# EAGLE schematic 408_jetracer_append_board (EAGLE 9.6.2)
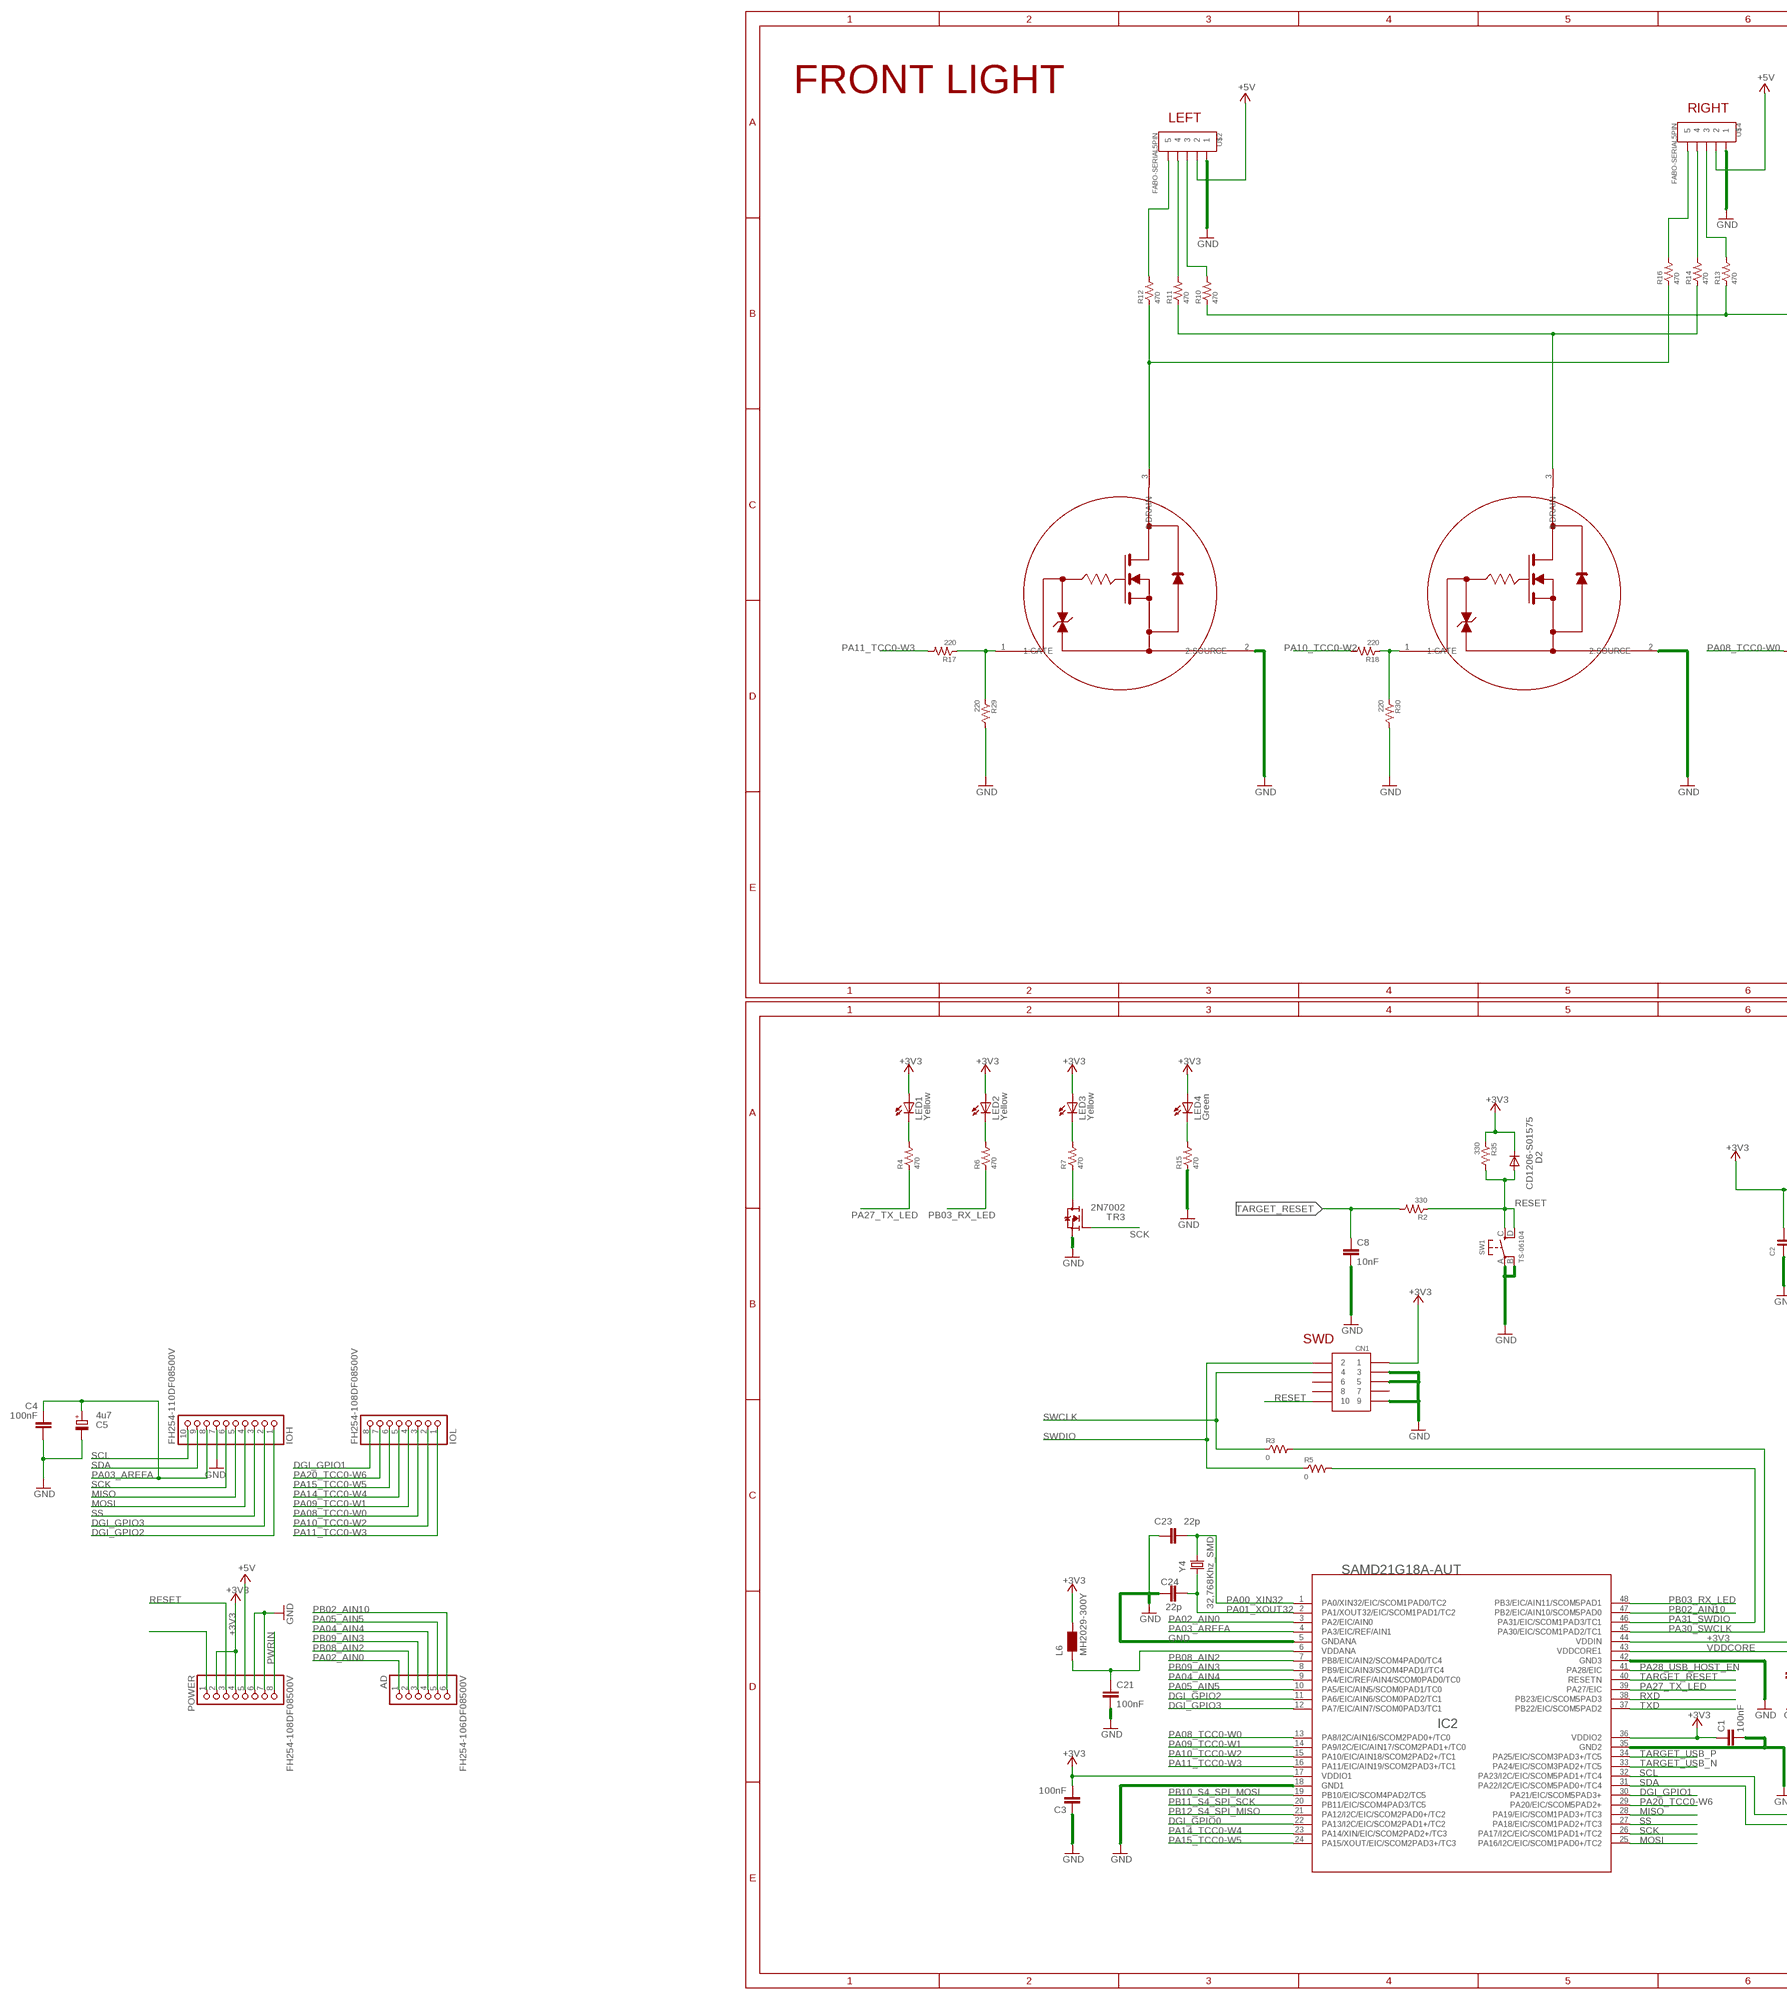
[diagram p0: schematic, sheet 1, part 1 of 2]
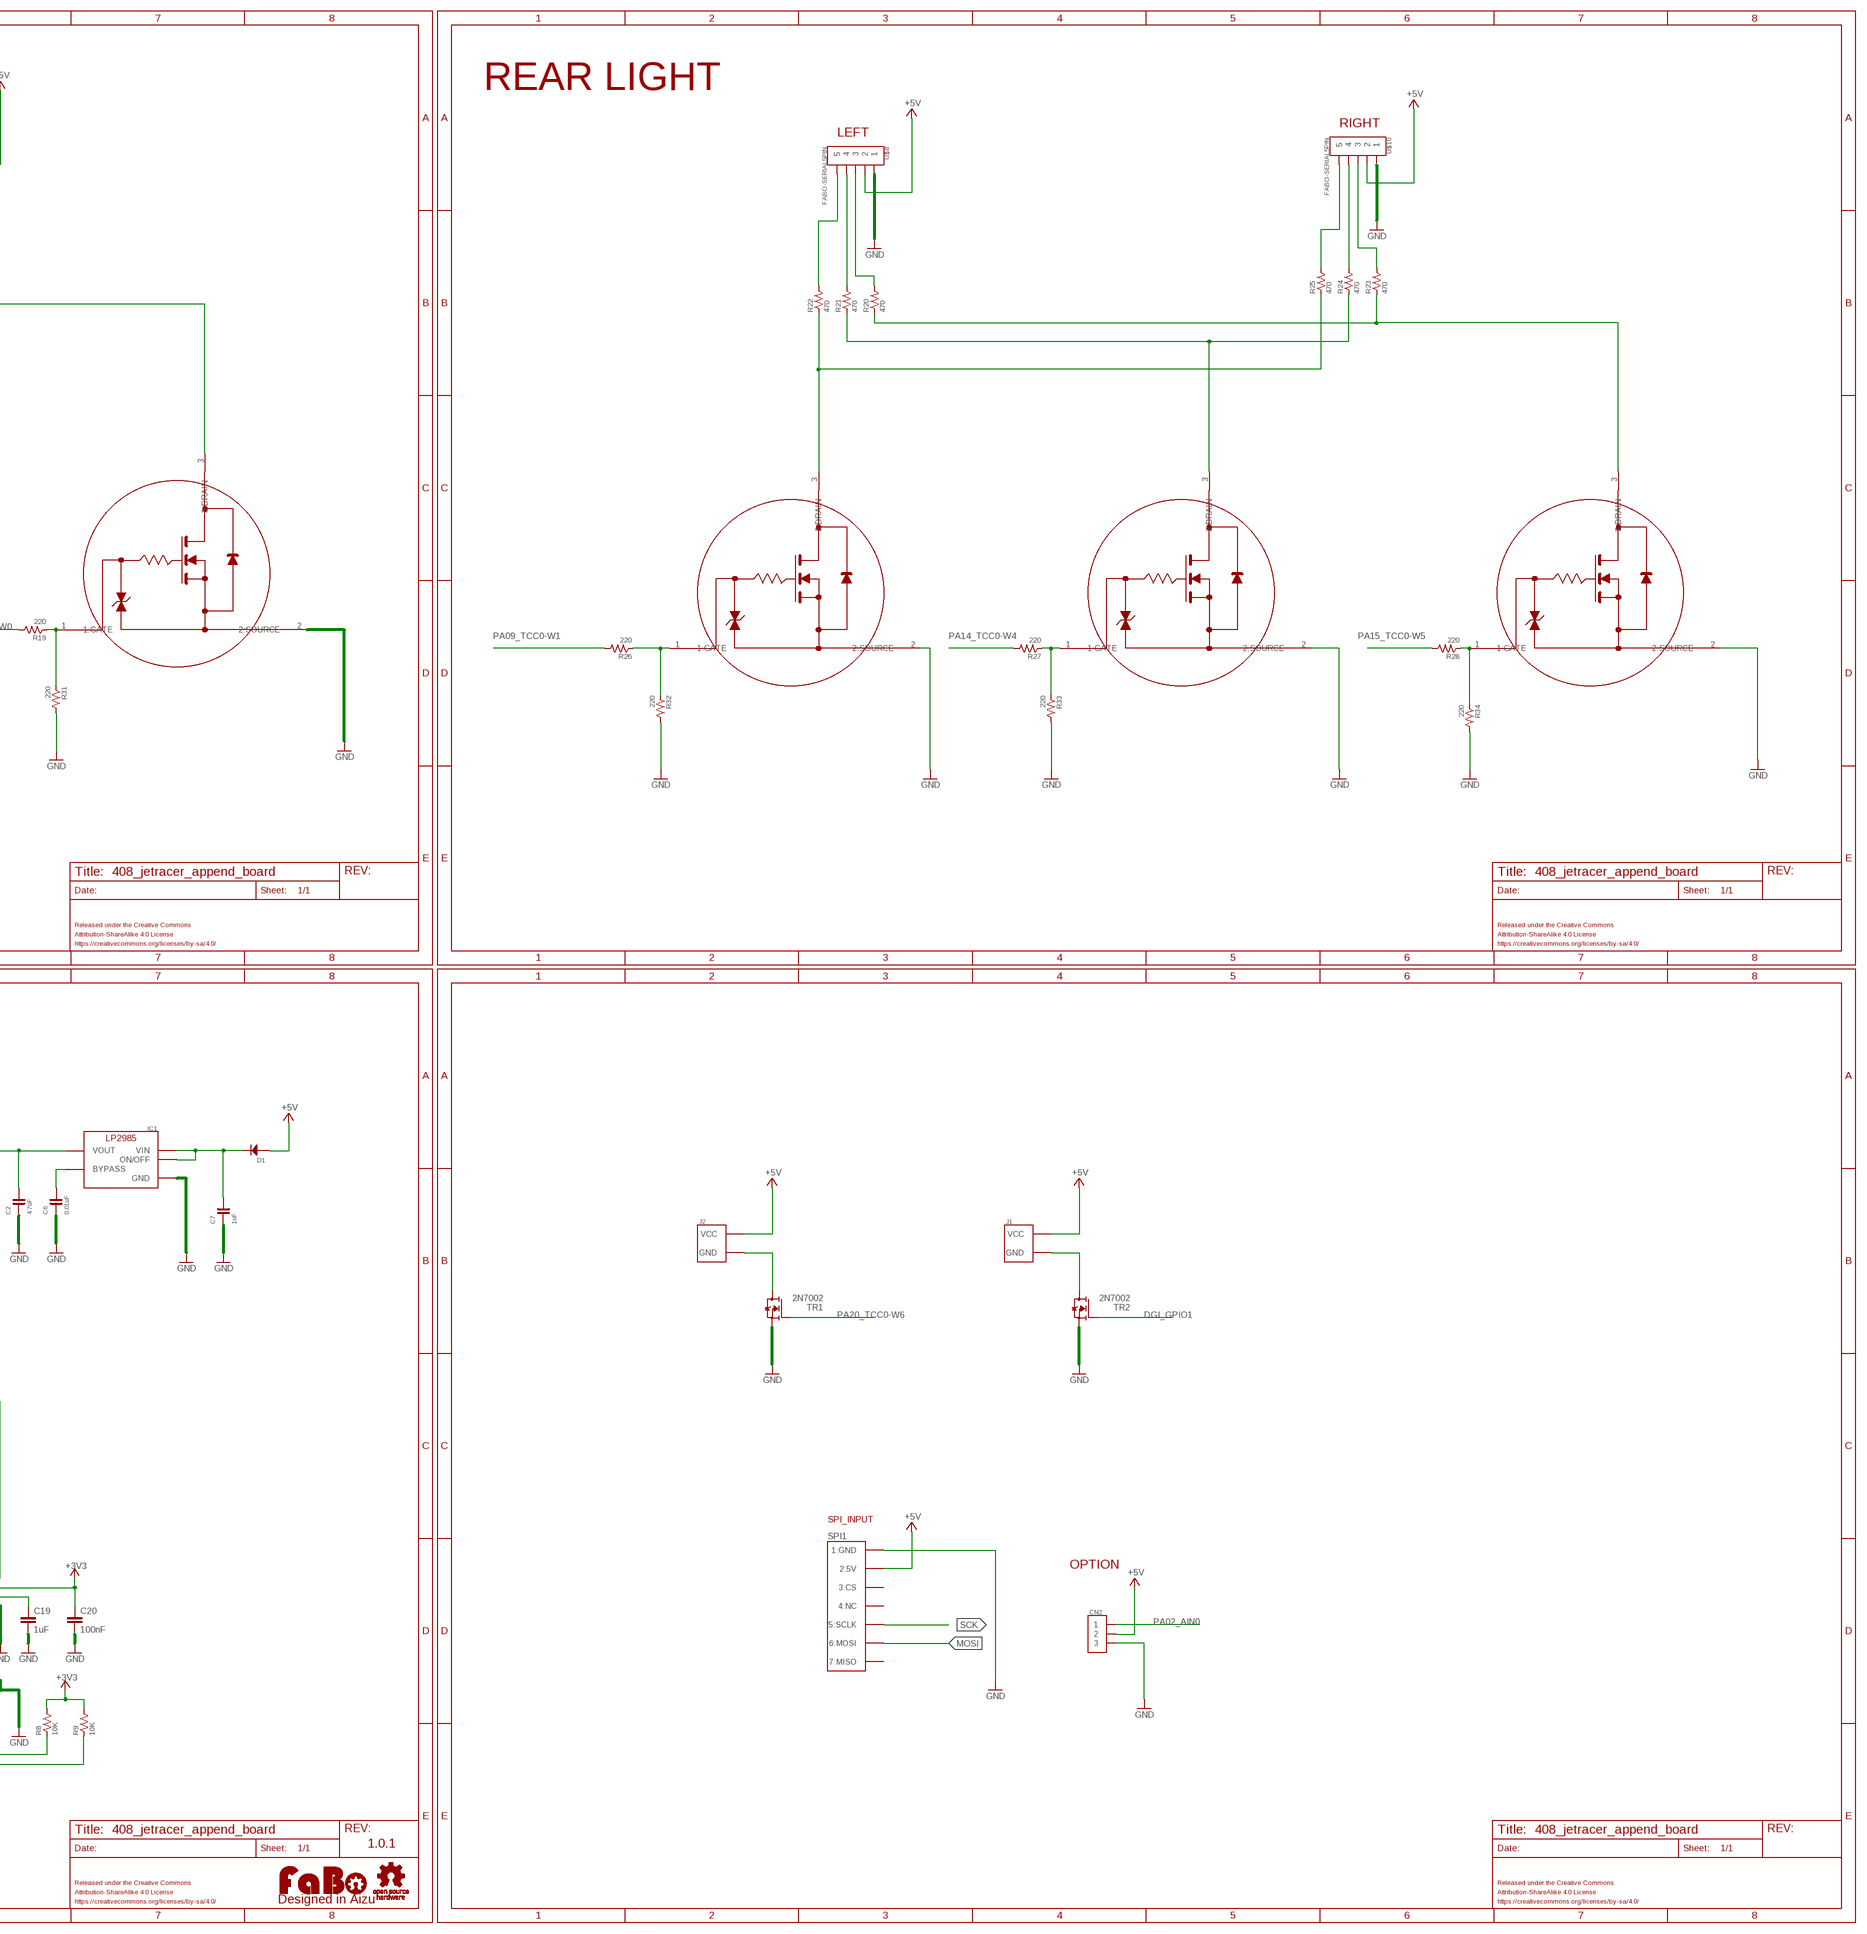
[diagram p1: schematic, sheet 1, part 2 of 2]

## Parts
AD  FH254-106DF08500V  1682_20TW-535_STD  [1X06]
C1  100nF  0015_100NF_0603  [C0603-ROUND]
C2  4.7uF  CAPACITOR-0603  [0603]
C3  100nF  0015_100NF_0603  [C0603-ROUND]
C4  100nF  0015_100NF_0603  [C0603-ROUND]
C5  4u7  0474_TAJA475M016RNJ  [SMC_A]
C6  0.01uF  CAPACITOR-0603  [0603]
C7  1uF  CAPACITOR-0603  [0603]
C8  10nF  0142_10NF_0603  [C0603-ROUND]
C19  1uF  0006_1UF_0603/GRM188R61E105KA12D  [C0603-ROUND]
C20  100nF  0015_100NF_0603  [C0603-ROUND]
C21  100nF  0015_100NF_0603  [C0603-ROUND]
C23  22p  0014_22PF_0603  [C0603-ROUND]
C24  22p  0014_22PF_0603  [C0603-ROUND]
CN1  PIN-HEADER-SMT(1.27MM)2X5  [PIN-HEADER-SMT(1.27MM)2X5]
CN2  PIN_1X3  [PIN_1X3]
D1  DIODE-SOD-323  [SOD-323]
D2  CD1206-S01575  0012_CD1206-S01575  [MINIMELF]
IC1  LP2985-33DBV  [SOT-23-5]
IC2  SAMD21G18A-AUT  1792_SAMD21G18A-AUT  [TQFP48-7X7]
IOH  FH254-110DF08500V  1684_20TW-537  [1X10]
IOL  FH254-108DF08500V  1683_20TW-536  [1X08]
J1  FABO_BRICK_2PIN  [FABO_BRICK_2PIN_B02B-PASK-1_SILK]
J2  FABO_BRICK_2PIN  [FABO_BRICK_2PIN_B02B-PASK-1_SILK]
L6  MH2029-300Y  0001_BLM21PG300SN1D_/_MH2029-300Y  [0805]
LED1  Yellow  0044_KPT-2012YC  [CHIPLED_0805]
LED2  Yellow  0044_KPT-2012YC  [CHIPLED_0805]
LED3  Yellow  0044_KPT-2012YC  [CHIPLED_0805]
LED4  Green  0043_KPT-2012SGC  [CHIPLED_0805]
LOGO1  LOGO_OSHW-M_BOTTOM  [LOGO_OSHW_M_BOTTOM]
LOGO2  LOGO_FABO-M_BOTTOM  [LOGO_FABO_M_BOTTOM]
POWER  FH254-108DF08500V  1683_20TW-536  [1X08]
R2  330  RESISTOR-0603  [0603]
R3  0  RESISTOR-0603  [0603]
R4  470  RESISTOR-0603  [0603]
R5  0  RESISTOR-0603  [0603]
R6  470  RESISTOR-0603  [0603]
R7  470  RESISTOR-0603  [0603]
R8  10K  RESISTOR-0603  [0603]
R9  10K  RESISTOR-0603  [0603]
R10  470  RESISTOR-0603  [0603]
R11  470  RESISTOR-0603  [0603]
R12  470  RESISTOR-0603  [0603]
R13  470  RESISTOR-0603  [0603]
R14  470  RESISTOR-0603  [0603]
R15  470  RESISTOR-0603  [0603]
R16  470  RESISTOR-0603  [0603]
R17  220  RESISTOR-0603  [0603]
R18  220  RESISTOR-0603  [0603]
R19  220  RESISTOR-0603  [0603]
R20  470  RESISTOR-0603  [0603]
R21  470  RESISTOR-0603  [0603]
R22  470  RESISTOR-0603  [0603]
R23  470  RESISTOR-0603  [0603]
R24  470  RESISTOR-0603  [0603]
R25  470  RESISTOR-0603  [0603]
R26  220  RESISTOR-0603  [0603]
R27  220  RESISTOR-0603  [0603]
R28  220  RESISTOR-0603  [0603]
R29  220  RESISTOR-0603  [0603]
R30  220  RESISTOR-0603  [0603]
R31  220  RESISTOR-0603  [0603]
R32  220  RESISTOR-0603  [0603]
R33  220  RESISTOR-0603  [0603]
R34  220  RESISTOR-0603  [0603]
R35  330  RESISTOR-0603  [0603]
SPI1  FABO-SPI-7PIN  [SPI-B07B-PASK-1]
SW1  TS-06104  [TS-06104]
TR1  2N7002  1612_2N7002LT1G  [SOT-23]
TR2  2N7002  1612_2N7002LT1G  [SOT-23]
TR3  2N7002  1612_2N7002LT1G  [SOT-23]
U$2  FABO-SERIAL5PIN  [BM05B-PASS-1]
U$4  FABO-SERIAL5PIN  [BM05B-PASS-1]
U$5  T2N7002AK  [SOT-23]
U$6  T2N7002AK  [SOT-23]
U$7  T2N7002AK  [SOT-23]
U$8  FABO-SERIAL5PIN  [BM05B-PASS-1]
U$10  FABO-SERIAL5PIN  [BM05B-PASS-1]
U$11  T2N7002AK  [SOT-23]
U$12  T2N7002AK  [SOT-23]
U$13  T2N7002AK  [SOT-23]
Y4  32,768Khz_SMD  0213_ABS07-32.768KHZ-T  [RESONATOR_EPSON_FC_145]

## Nets
+3V3: C1.1 C2.2 C3.2 C20.1 CN1.1 D2.C IC1.5(VOUT) IC2.17(VDDIO1) IC2.36(VDDIO2) IC2.44(VDDIN) L6.2 LED1.A LED2.A LED3.A LED4.A POWER.2 POWER.4 R8.2 R9.2 R35.1
+5V [usbvcc]: CN2.2 D1.A(ANODE) J1.VCC J2.VCC POWER.5 SPI1.2(2:5V) U$2.2 U$4.2 U$8.2 U$10.2
DGI_GPIO0: IC2.22(PA13/I2C/EIC/SCOM2PAD1+/TC2)
DGI_GPIO1: IC2.30(PA21/EIC/SCOM5PAD3+) IOL.8 TR2.3(G)
DGI_GPIO2: IC2.11(PA6/EIC/AIN6/SCOM0PAD2/TC1) IOH.1
DGI_GPIO3: IC2.12(PA7/EIC/AIN7/SCOM0PAD3/TC1) IOH.2
GND [gnd]: C1.2 C2.1 C3.1 C4.2 C5.- C6.1 C7.1 C8.2 C19.2 C20.2 C21.2 C23.1 C24.1 CN1.3 CN1.5 CN1.9 CN2.3 IC1.2(GND) IC2.5(GNDANA) IC2.18(GND1) IC2.35(GND2) IC2.42(GND3) IOH.7 POWER.6 POWER.7 R15.1 R29.2 R30.2 R31.2 R32.2 R33.2 R34.2 SPI1.1(1:GND) SW1.A SW1.B TR1.2(S) TR2.2(S) TR3.2(S) U$2.1 U$4.1 U$5.2(2:SOURCE) U$6.2(2:SOURCE) U$7.2(2:SOURCE) U$8.1 U$10.1 U$11.2(2:SOURCE) U$12.2(2:SOURCE) U$13.2(2:SOURCE)
MISO: IC2.28(PA19/EIC/SCOM1PAD3+/TC3) IOH.5
MOSI: IC2.25(PA16/I2C/EIC/SCOM1PAD0+/TC2) IOH.4 SPI1.6(6:MOSI)
N$1: LED1.C R4.2
N$2: LED2.C R6.2
N$3: LED3.C R7.2
N$4: LED4.C R15.2
N$5: R7.1 TR3.1(D)
N$6: R12.2 U$2.5
N$7: C6.2 IC1.4(BYPASS)
N$8: R12.1 R16.1 U$5.3(3:DRAIN)
N$9: R11.2 U$2.4
N$10: C21.1 IC2.6(VDDANA) L6.1
N$11: R10.2 U$2.3
N$12: R16.2 U$4.5
N$13: R14.2 U$4.4
N$14: R13.2 U$4.3
N$15: R10.1 R13.1 U$7.3(3:DRAIN)
N$16: R11.1 R14.1 U$6.3(3:DRAIN)
N$17: R17.1 R29.1 U$5.1(1:GATE)
N$18: R18.1 R30.1 U$6.1(1:GATE)
N$19: R19.1 R31.1 U$7.1(1:GATE)
N$20: R22.2 U$8.5
N$21: R21.2 U$8.4
N$22: R20.2 U$8.3
N$23: R25.2 U$10.5
N$24: R24.2 U$10.4
N$25: R23.2 U$10.3
N$26: R22.1 R25.1 U$11.3(3:DRAIN)
N$27: R21.1 R24.1 U$12.3(3:DRAIN)
N$28: R20.1 R23.1 U$13.3(3:DRAIN)
N$29: R26.1 R32.1 U$11.1(1:GATE)
N$30: R27.1 R33.1 U$12.1(1:GATE)
N$31: R28.1 R34.1 U$13.1(1:GATE)
N$32 [usbvcc]: C7.2 D1.K(CATHODE) IC1.1(VIN) IC1.3(ON/OFF)
N$33: J2.GND1(GND) TR1.1(D)
N$34: J1.GND1(GND) TR2.1(D)
N$56: POWER.1
PA00_XIN32: C23.2 IC2.1(PA0/XIN32/EIC/SCOM1PAD0/TC2) Y4.P$2
PA01_XOUT32: C24.2 IC2.2(PA1/XOUT32/EIC/SCOM1PAD1/TC2) Y4.P$1
PA02_AIN0: AD.1 CN2.1 IC2.3(PA2/EIC/AIN0)
PA03_AREFA: C4.1 C5.+ IC2.4(PA3/EIC/REF/AIN1) IOH.8
PA04_AIN4: AD.4 IC2.9(PA4/EIC/REF/AIN4/SCOM0PAD0/TC0)
PA05_AIN5: AD.5 IC2.10(PA5/EIC/AIN5/SCOM0PAD1/TC0)
PA08_TCC0-W0: IC2.13(PA8/I2C/AIN16/SCOM2PAD0+/TC0) IOL.3 R19.2
PA09_TCC0-W1: IC2.14(PA9/I2C/EIC/AIN17/SCOM2PAD1+/TC0) IOL.4 R26.2
PA10_TCC0-W2: IC2.15(PA10/EIC/AIN18/SCOM2PAD2+/TC1) IOL.2 R18.2
PA11_TCC0-W3: IC2.16(PA11/EIC/AIN19/SCOM2PAD3+/TC1) IOL.1 R17.2
PA14_TCC0-W4: IC2.23(PA14/XIN/EIC/SCOM2PAD2+/TC3) IOL.5 R27.2
PA15_TCC0-W5: IC2.24(PA15/XOUT/EIC/SCOM2PAD3+/TC3) IOL.6 R28.2
PA20_TCC0-W6: IC2.29(PA20/EIC/SCOM5PAD2+) IOL.7 TR1.3(G)
PA27_TX_LED: IC2.39(PA27/EIC) R4.1
PA28_USB_HOST_EN: IC2.41(PA28/EIC)
PA30_SWCLK: IC2.45(PA30/EIC/SCOM1PAD2/TC1) R3.2
PA31_SWDIO: IC2.46(PA31/EIC/SCOM1PAD3/TC1) R5.2
PB02_AIN10: AD.6 IC2.47(PB2/EIC/AIN10/SCOM5PAD0)
PB03_RX_LED: IC2.48(PB3/EIC/AIN11/SCOM5PAD1) R6.1
PB08_AIN2: AD.2 IC2.7(PB8/EIC/AIN2/SCOM4PAD0/TC4)
PB09_AIN3: AD.3 IC2.8(PB9/EIC/AIN3/SCOM4PAD1//TC4)
PB10_S4_SPI_MOSI: IC2.19(PB10/EIC/SCOM4PAD2/TC5)
PB11_S4_SPI_SCK: IC2.20(PB11/EIC/SCOM4PAD3/TC5)
PB12_S4_SPI_MISO: IC2.21(PA12/I2C/EIC/SCOM2PAD0+/TC2)
PWRIN [USB]: POWER.8
RESET: CN1.10 D2.A POWER.3 R2.1 R35.2 SW1.C SW1.D
RXD: IC2.38(PB23/EIC/SCOM5PAD3)
SCK: IC2.26(PA17/I2C/EIC/SCOM1PAD1+/TC2) IOH.6 SPI1.5(5:SCLK) TR3.3(G)
SCL: IC2.32(PA23/I2C/EIC/SCOM5PAD1+/TC4) IOH.10 R8.1
SDA: IC2.31(PA22/I2C/EIC/SCOM5PAD0+/TC4) IOH.9 R9.1
SS: IC2.27(PA18/EIC/SCOM1PAD2+/TC3) IOH.3
SWCLK: CN1.4 R3.1
SWDIO: CN1.2 R5.1
TARGET_RESET: C8.1 IC2.40(RESETN) R2.2
TARGET_USB_N [USBpair]: IC2.33(PA24/EIC/SCOM3PAD2+/TC5)
TARGET_USB_P [USBpair]: IC2.34(PA25/EIC/SCOM3PAD3+/TC5)
TXD: IC2.37(PB22/EIC/SCOM5PAD2)
VDDCORE: C19.1 IC2.43(VDDCORE1)
Unconnected: CN1.6 CN1.7 CN1.8 SPI1.3(3:CS) SPI1.4(4:NC) SPI1.7(7:MISO)

## Notes on the sheet
- FRONT LIGHT | REAR LIGHT
- RIGHT
- LEFT
- RIGHT
- LEFT
- SWD
- SPI_INPUT
- OPTION
- 1.0.1

## Library data of the parts
AD = Connettori:1682_20TW-535: Female Gray Connector strip for Arduino 3V3 bases - 6x1 F V h 8,5 p2,54; MONTHLY_USAGE: 86722.85; PART_NUMBER: 20TW-535; PRICE: _0.03; SUPPLIER: CBC_elettronica__s.r.l.; TYPE: Connettori
C1 C3 C4 C20 C21 = Condensatori:0015_100NF_0603: 100nF 0603 50V; CASE: 0603; MONTHLY_USAGE: _____; PART_NUMBER: cl10b104kbnc; PRICE: _____; SUPPLIER: _____; TYPE: Condensatori
C2 C6 C7 = FaBo-Capacitor:CAPACITOR: CAPACITOR
C5 = Condensatori:0474_TAJA475M016RNJ: 4u7 tantalio Case A - testa gialla -Tantalio; CASE: CaseA_(1206); MONTHLY_USAGE: _____; PART_NUMBER: TAJA475M016RNJ; PRICE: _____; SUPPLIER: _____; TYPE: Condensatori
C8 = Condensatori:0142_10NF_0603: 10nF 0603; CASE: 0603; MONTHLY_USAGE: _____; PART_NUMBER: 10nF_0603; PRICE: _____; SUPPLIER: _____; TYPE: Condensatori
C19 = Condensatori:0006_1UF_0603/GRM188R61E105KA12D: 1uF 0603; CASE: 0603; MONTHLY_USAGE: _____; PART_NUMBER: 1uF_0603/GRM188R61E105KA12D; PRICE: _____; SUPPLIER: _____; TYPE: Condensatori
C23 C24 = Condensatori:0014_22PF_0603: 22pF 0603; CASE: 0603; MONTHLY_USAGE: _____; PART_NUMBER: 22pF_0603; PRICE: _____; SUPPLIER: _____; TYPE: Condensatori
CN1 = FaBo-PIN:PIN-HEADER-SMT(1.27MM)2X5
CN2 = FaBo-PIN:PIN_1X3
D1 = FaBo-Diode:DIODE
D2 = Diodi:0012_CD1206-S01575: small-signal high-speed Switching Diodes CD1206; CASE: 1206; MONTHLY_USAGE: _____; PART_NUMBER: CD1206-S01575; PRICE: _____; SUPPLIER: _____; TYPE: Diodi
IC1 = FaBo-Supply:LP2985: LP2985
IC2 = IntegratedCircuits:1792_SAMD21G18A-AUT: Atmel D21 32bit ARM Cortex-M0 microcontroller - 48 PIN TQFP 256KB flash memory + 32KB SRAM
IOH = Connettori:1684_20TW-537: Female Gray Connector strip for Arduino 3V3 bases - 10x1 F V h 8,5 p2,54mm; MONTHLY_USAGE: _____; PART_NUMBER: 20TW-537; PRICE: _____; SUPPLIER: _____; TYPE: Connettori
IOL POWER = Connettori:1683_20TW-536: Female Gray Connector strip for Arduino 3V3 bases - 8x1 F V h 8,5 p2,54mm; MONTHLY_USAGE: _____; PART_NUMBER: 20TW-536; PRICE: _____; SUPPLIER: _____; TYPE: Connettori
J1 J2 = FaBo-Template:FABO_BRICK_2PIN
L6 = Protezione:0001_BLM21PG300SN1D_/_MH2029-300Y: BLM21; MONTHLY_USAGE: _____; PART_NUMBER: BLM21PG300SN1D_/_MH2029-300Y; PRICE: _____; SUPPLIER: _____; TYPE: Protezione
LED1-LED3 = Opto:0044_KPT-2012YC: LED YELLOW - SMD - 0805; MONTHLY_USAGE: _____; PART_NUMBER: KPT-2012YC; PRICE: _____; SUPPLIER: _____; TYPE: Opto
LED4 = Opto:0043_KPT-2012SGC: LED GREEN - SMD-0805; MONTHLY_USAGE: _____; PART_NUMBER: KPT-2012SGC; PRICE: _____; SUPPLIER: _____; TYPE: Opto
LOGO1 = FaBo-Logo:LOGO_OSHW
LOGO2 = FaBo-Logo:LOGO_FABO
R2-R35 = FaBo-Resistors:RESISTOR: RESISTOR
SPI1 = FaBo-Connetor:FABO-SPI-7PIN
SW1 = FaBo-Switch:TS-06104
TR1-TR3 = Transistors:1612_2N7002LT1G: 2N7002 60 V, 300 mA N-channel Trench MOSFET
U$2 U$4 U$8 U$10 = FaBo-Connetor:FABO-SERIAL5PIN
U$5-U$7 U$11-U$13 = FaBo-Mosfet:T2N7002AK
Y4 = Cristalli:0213_ABS07-32.768KHZ-T: 32,768KHz - SMD; MONTHLY_USAGE: _____; PART_NUMBER: ABS07-32.768KHZ-T; PRICE: _____; SUPPLIER: _____; TYPE: Cristalli

## Net classes
0 default: width 0.203 mm, drill 0.406 mm, clearance 0.203 mm
1 USB: width 0.203 mm, drill 0.305 mm, clearance 0.178 mm
2 gnd: width 0.254 mm, drill 0.254 mm, clearance 0.178 mm
3 usbvcc: width 0.203 mm, drill 0.406 mm, clearance 0.178 mm
4 USBpair: width 0.254 mm, drill 0.406 mm, clearance 0.406 mm